# Altium schematic sheet Reciever Schematic.SchDoc
size A; Date: 07/13/2023; SheetNumber: 1; SheetTotal: 1
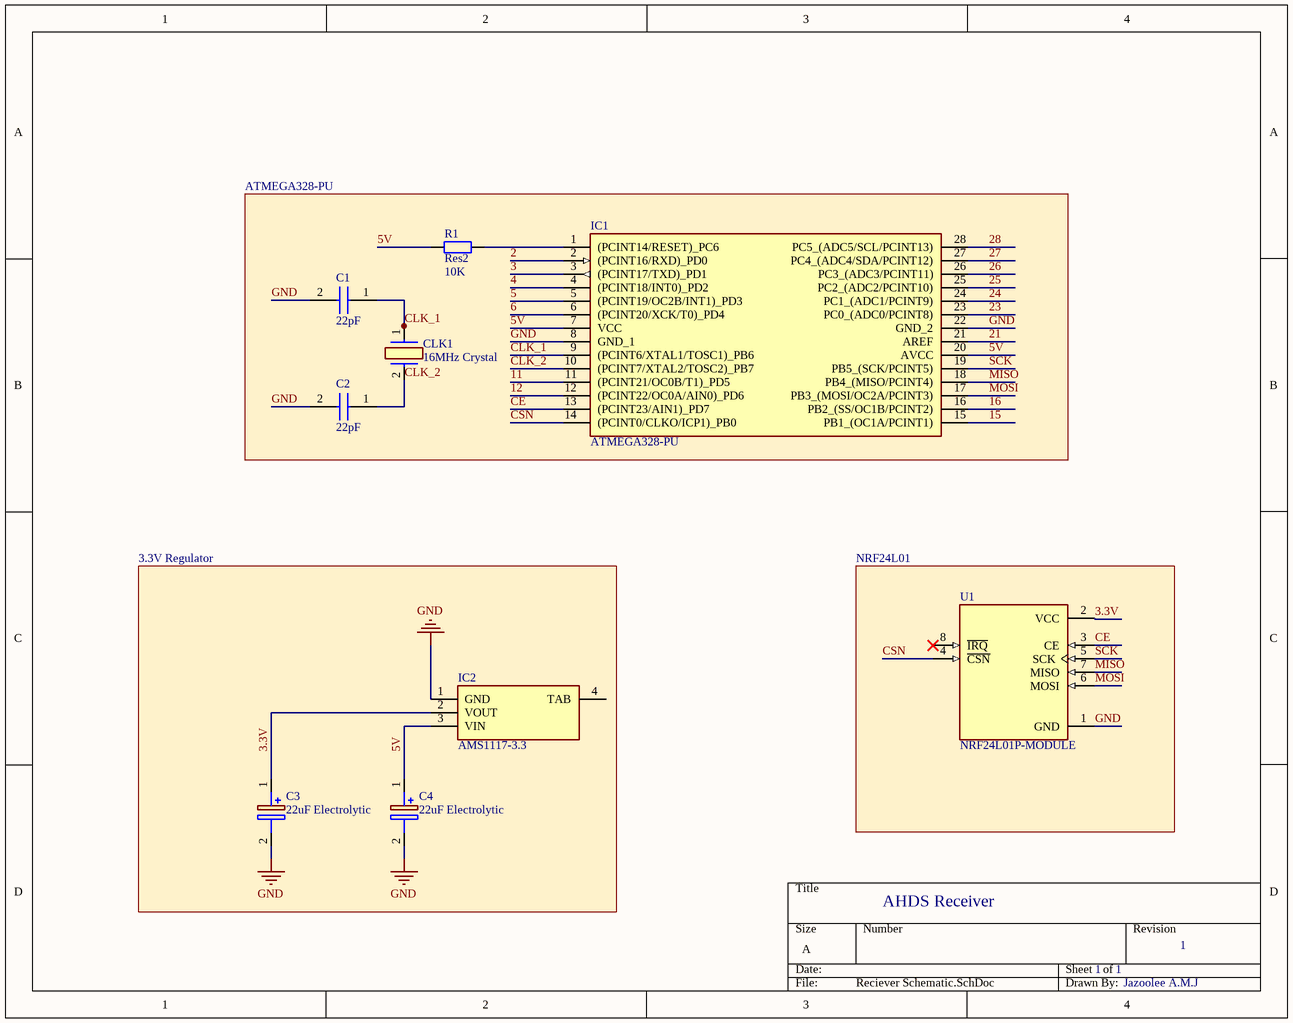
[diagram p0: Reciever Schematic.SchDoc]

## Parts
C1  22pF  [S220K25SL0N63L6R]
C2  22pF  [S220K25SL0N63L6R]
C3  22uF Electrolytic  [CAPPRD250W55D630H1220]
C4  22uF Electrolytic  [CAPPRD250W55D630H1220]
CLK1  16MHz Crystal  [LFXTAL036391Bulk]
IC1  ATMEGA328-PU  [DIP1016W53P254L3468H457Q28N]
IC2  AMS1117-3.3  [SOT229P700X180-4N]
R1  Res2  value 10K  [AXIAL-0.4]
U1  NRF24L01P-MODULE  [XCVR_NRF24L01P-MODULE-PCB]

## Blocks framed on the sheet
ATMEGA328-PU: C1 C2 CLK1 IC1 R1
3.3V Regulator: C3 C4 IC2
NRF24L01: U1

## Nets
GND: C1.2 C2.2 C3.2(-) C4.2(-) IC1.8(GND_1) IC1.22(GND_2) IC2.1(GND) U1.1(GND)
2: IC1.2((PCINT16/RXD)_PD0)
3: IC1.3((PCINT17/TXD)_PD1)
3.3V: C3.1(+) IC2.2(VOUT) U1.2(VCC)
4: IC1.4((PCINT18/INT0)_PD2)
5: IC1.5((PCINT19/OC2B/INT1)_PD3)
5V: C4.1(+) IC1.7(VCC) IC1.20(AVCC) IC2.3(VIN) R1.1
6: IC1.6((PCINT20/XCK/T0)_PD4)
11: IC1.11((PCINT21/OC0B/T1)_PD5)
12: IC1.12((PCINT22/OC0A/AIN0)_PD6)
15: IC1.15(PB1_(OC1A/PCINT1))
16: IC1.16(PB2_(SS/OC1B/PCINT2))
21: IC1.21(AREF)
23: IC1.23(PC0_(ADC0/PCINT8))
24: IC1.24(PC1_(ADC1/PCINT9))
25: IC1.25(PC2_(ADC2/PCINT10))
26: IC1.26(PC3_(ADC3/PCINT11))
27: IC1.27(PC4_(ADC4/SDA/PCINT12))
28: IC1.28(PC5_(ADC5/SCL/PCINT13))
CE: IC1.13((PCINT23/AIN1)_PD7) U1.3(CE)
CLK_1: C1.1 CLK1.1(CRYSTAL_1) IC1.9((PCINT6/XTAL1/TOSC1)_PB6)
CLK_2: C2.1 CLK1.2(CRYSTAL_2) IC1.10((PCINT7/XTAL2/TOSC2)_PB7)
CSN: IC1.14((PCINT0/CLKO/ICP1)_PB0) U1.4(~{CSN})
MISO: IC1.18(PB4_(MISO/PCINT4)) U1.7(MISO)
MOSI: IC1.17(PB3_(MOSI/OC2A/PCINT3)) U1.6(MOSI)
SCK: IC1.19(PB5_(SCK/PCINT5)) U1.5(SCK)
NetIC1_1: IC1.1((PCINT14/RESET)_PC6) R1.2

Not connected (* = marked no-connect by the designer): IC2 4(TAB); U1 8(~{IRQ})*

## Notes on the sheet
- AHDS Receiver
- 1
- Jazoolee A.M.J

## Library data of the parts
C1 C2 = S220K25SL0N63L6R: Capacitor Ceramic THT; Manufacturer_Name: Vishay; Datasheet Link: http://www.vishay.com/docs/28515/sseries.pdf; Height: 6.5mm; Manufacturer_Part_Number: S220K25SL0N63L6R; Mouser Part Number: 594-S220K25SL0N63L6R; Mouser Price/Stock: https://www.mouser.co.uk/ProductDetail/Vishay-BC-Components/S220K25SL0N63L6R?qs=a%252BZougrH3ehuV7s4gtTaOA%3D%3D; Arrow Part Number: S220K25SL0N63L6R; Arrow Price/Stock: https://www.arrow.com/en/products/s220k25sl0n63l6r/vishay?region=nac
C3 C4 = ECA1EEN220: Capacitor Polarised; Manufacturer_Name: Panasonic; Datasheet Link: http://industrial.panasonic.com/cdbs/www-data/pdf/RDF0000/ABA0000C1044.pdf; Height: 12.2mm; Manufacturer_Part_Number: ECA1EEN220
CLK1 = LFXTAL036391Bulk: Crystal or Oscillator; Manufacturer_Name: IQD; Datasheet Link: https://componentsearchengine.com/Datasheets/1/LFXTAL036391Bulk.pdf; Height: 4.1mm; Manufacturer_Part_Number: LFXTAL036391Bulk; Mouser Part Number: 449-LFXTAL036391BULK; Mouser Price/Stock: https://www.mouser.co.uk/ProductDetail/IQD/LFXTAL036391Bulk?qs=e4%2FAndAAwgLVSm%2FKWOsYLg%3D%3D
IC1 = ATMEGA328-PU: Integrated Circuit; Manufacturer_Name: Microchip; Datasheet Link: https://componentsearchengine.com/Datasheets/1/ATMEGA328-PU.pdf; Height: 4.572mm; Manufacturer_Part_Number: ATMEGA328-PU; Mouser Part Number: 556-ATMEGA328-PU; Mouser Price/Stock: https://www.mouser.co.uk/ProductDetail/Microchip-Technology/ATMEGA328-PU?qs=lwdSMh1%2FoYJT8tfItQpQtA%3D%3D; Arrow Part Number: ATMEGA328-PU; Arrow Price/Stock: https://www.arrow.com/en/products/atmega328-pu/microchip-technology?region=nac
IC2 = AMS1117-3.3: Integrated Circuit; Manufacturer_Name: Advanced Monolithic Systems; Datasheet Link: http://www.advanced-monolithic.com/pdf/ds1117.pdf; Height: 1.8mm; Manufacturer_Part_Number: AMS1117-3.3
R1 = Res2: Resistor; Published: 8-Jun-2000; LatestRevisionDate: 17-Jul-2002; LatestRevisionNote: Re-released for DXP Platform.; PackageReference: AXIAL-0.4; Publisher: Altium Limited; PackageDescription: Axial Device, Thru-Hole; 2 Leads; 0.4 in Pin Spacing
U1 = NRF24L01P-MODULE-PCB: - Transceiver For Use With nRF24L01+; MF: Nordic Semiconductor; Package: None; MP: NRF24L01P-MODULE-PCB; Value: *; Availability: Bad; Price: None; SnapEDA_Link: https://www.snapeda.com/parts/NRF24L01P-MODULE-PCB/Nordic%20Semiconductor%20ASA/view-part/230534/?ref=snap; Mouser-Purchase-URL: https://snapeda.com/shop?store=Mouser&id=230534